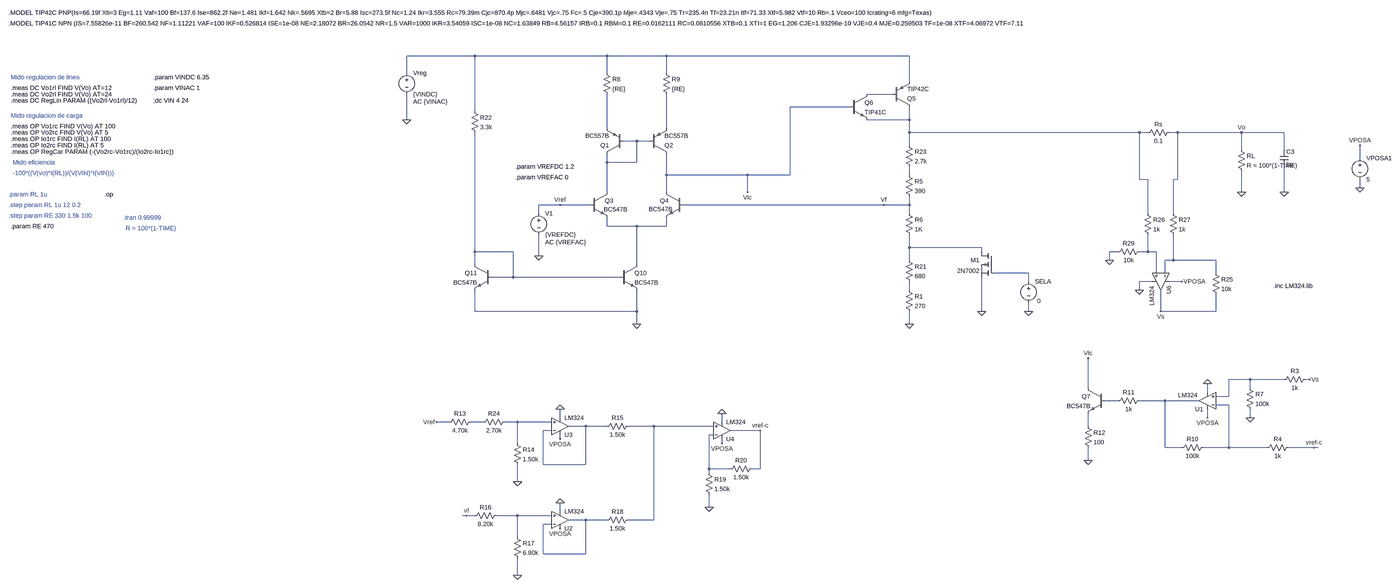
[diagram p0: schematic Simulacion - v8.asc, whole sheet]
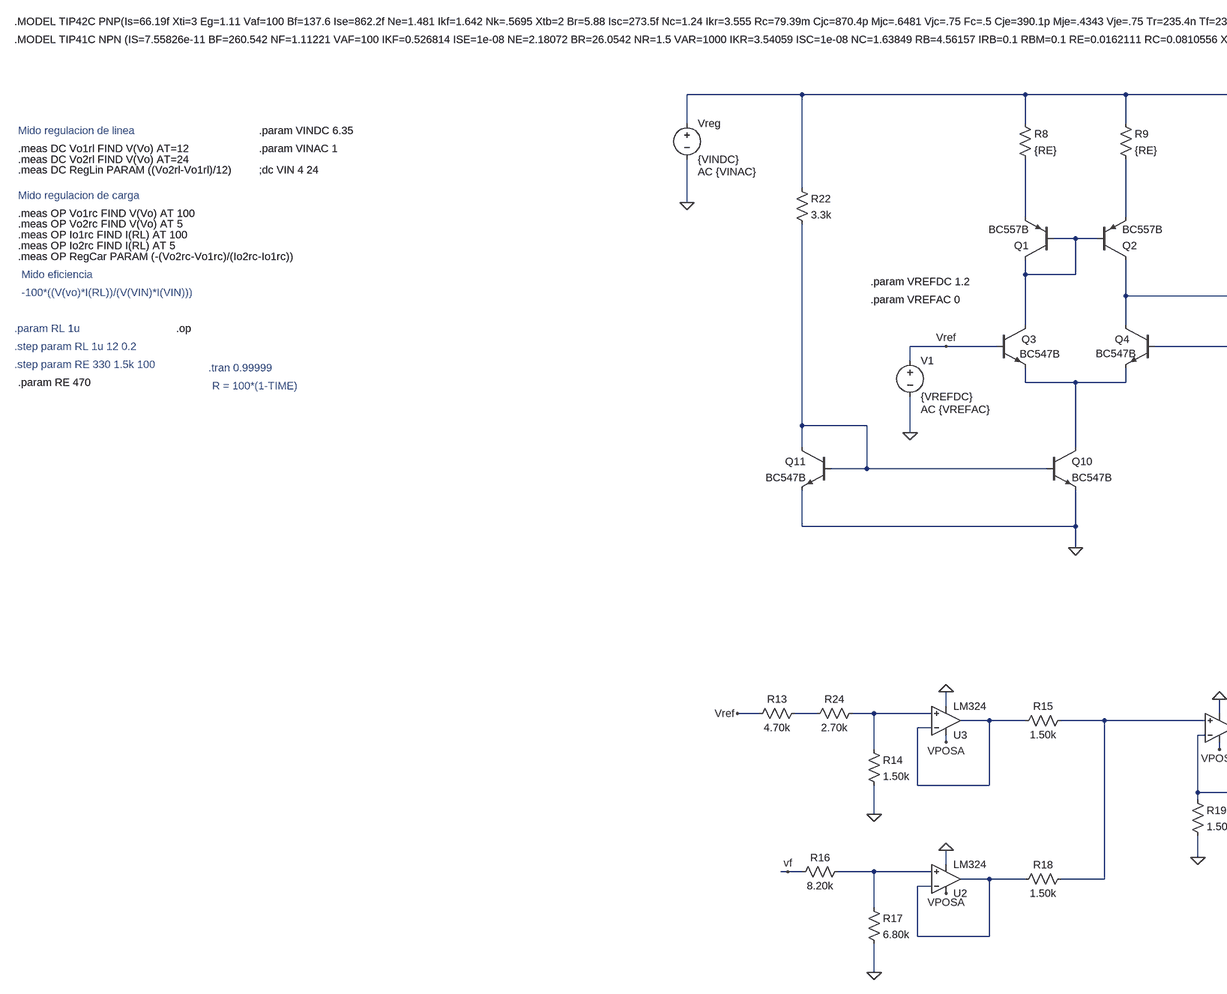
[diagram p1: schematic Simulacion - v8.asc, part, row 1 of 1, column 1 of 2]
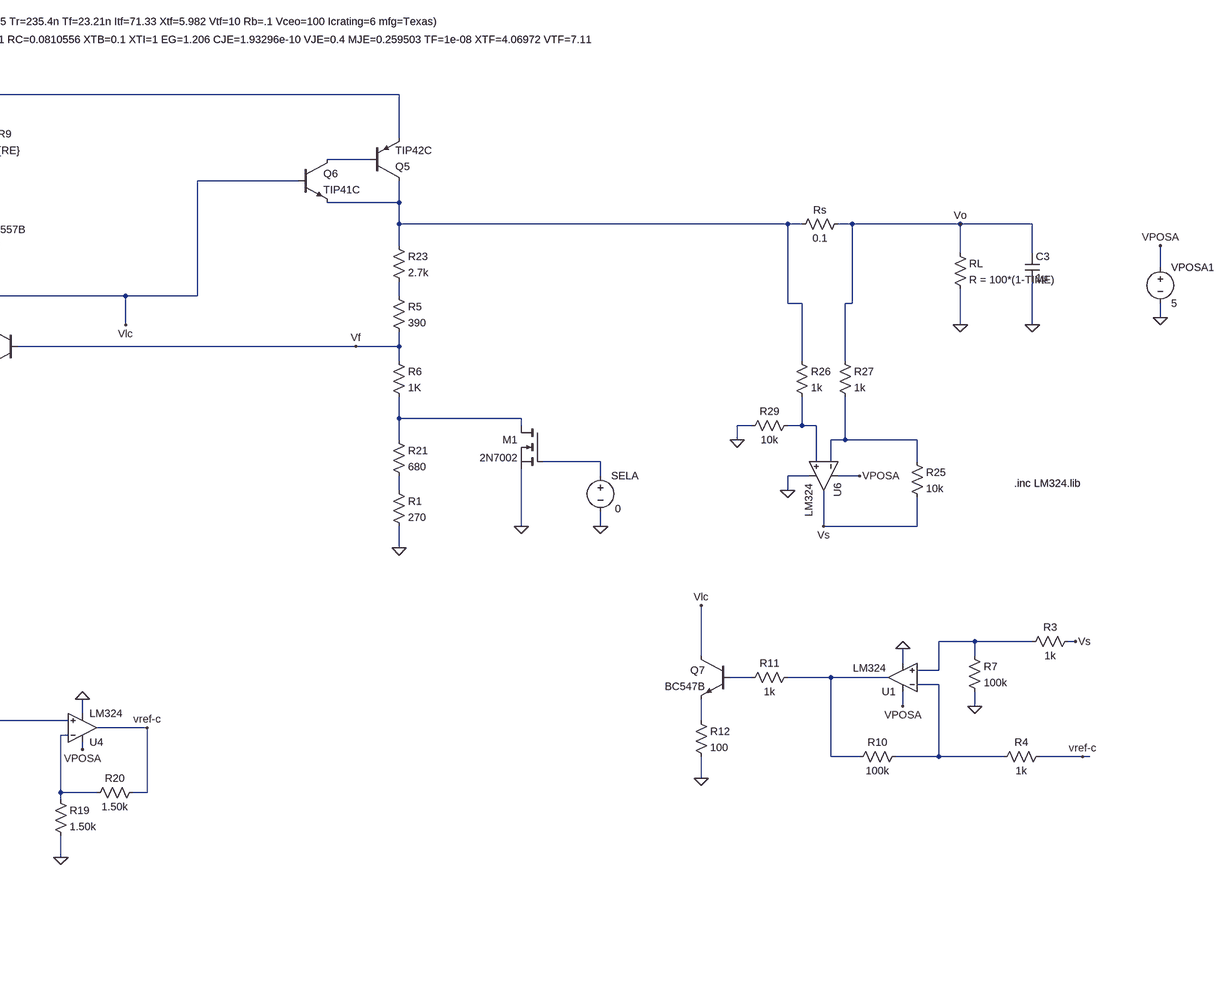
[diagram p2: schematic Simulacion - v8.asc, part, row 1 of 1, column 2 of 2]
Simulacion - v8.asc, the LTspice schematic file:
Version 4
SHEET 1 10276 2748
WIRE -160 -288 -416 -288
WIRE 336 -288 -160 -288
WIRE 560 -288 336 -288
WIRE 1472 -288 560 -288
WIRE -416 -224 -416 -288
WIRE 336 -224 336 -288
WIRE 560 -224 560 -288
WIRE 1472 -192 1472 -288
WIRE 1408 -144 1312 -144
WIRE 1248 -96 1024 -96
WIRE -160 -80 -160 -288
WIRE -416 -48 -416 -144
WIRE 1472 -48 1472 -96
WIRE 1472 -48 1312 -48
WIRE 336 -16 336 -144
WIRE 560 -16 560 -144
WIRE 1472 0 1472 -48
WIRE 2336 0 1472 0
WIRE 2368 0 2336 0
WIRE 2480 0 2448 0
WIRE 2720 0 2480 0
WIRE 2880 0 2720 0
WIRE 448 32 400 32
WIRE 496 32 448 32
WIRE 1472 48 1472 0
WIRE 2720 64 2720 0
WIRE 2880 64 2880 0
WIRE 3248 96 3248 48
WIRE 336 112 336 80
WIRE 448 112 448 32
WIRE 448 112 336 112
WIRE 560 160 560 80
WIRE 864 160 560 160
WIRE 1024 160 1024 -96
WIRE 1024 160 864 160
WIRE 1472 160 1472 128
WIRE 2336 176 2336 0
WIRE 2368 176 2336 176
WIRE 2480 176 2480 0
WIRE 2480 176 2464 176
WIRE 3248 208 3248 176
WIRE 336 224 336 112
WIRE 560 224 560 160
WIRE 864 224 864 160
WIRE 2720 224 2720 144
WIRE 2880 224 2880 128
WIRE 160 272 80 272
WIRE 272 272 160 272
WIRE 1376 272 624 272
WIRE 1472 272 1472 240
WIRE 1472 272 1376 272
WIRE 80 304 80 272
WIRE 1472 304 1472 272
WIRE 2368 304 2368 176
WIRE 2464 304 2464 176
WIRE 336 352 336 320
WIRE 448 352 336 352
WIRE 560 352 560 320
WIRE 560 352 448 352
WIRE 1472 432 1472 384
WIRE 1744 432 1472 432
WIRE -160 448 -160 0
WIRE -16 448 -160 448
WIRE 1744 448 1744 432
WIRE 2256 448 2224 448
WIRE 2368 448 2368 384
WIRE 2368 448 2336 448
WIRE 2400 448 2368 448
WIRE 80 464 80 384
WIRE 1472 480 1472 432
WIRE 2224 480 2224 448
WIRE 2464 480 2464 384
WIRE 2464 480 2432 480
WIRE 2624 480 2464 480
WIRE -160 496 -160 448
WIRE 448 496 448 352
WIRE 1920 528 1792 528
WIRE 2400 528 2400 448
WIRE 2432 528 2432 480
WIRE 2624 528 2624 480
WIRE -16 544 -16 448
WIRE -16 544 -96 544
WIRE 384 544 -16 544
WIRE 1920 560 1920 528
WIRE 2384 560 2336 560
WIRE 2496 560 2448 560
WIRE 1472 592 1472 560
WIRE 2336 592 2336 560
WIRE -160 672 -160 592
WIRE 448 672 448 592
WIRE 448 672 -160 672
WIRE 1744 672 1744 544
WIRE 1920 672 1920 640
WIRE 2416 672 2416 592
WIRE 2624 672 2624 608
WIRE 2624 672 2416 672
WIRE 448 720 448 672
WIRE 1472 720 1472 672
WIRE 2752 928 2672 928
WIRE 2880 928 2752 928
WIRE 2976 928 2960 928
WIRE 2144 960 2144 848
WIRE 2752 960 2752 928
WIRE 2592 976 2592 944
WIRE 2672 992 2672 928
WIRE 2672 992 2624 992
WIRE 2256 1008 2208 1008
WIRE 2432 1008 2336 1008
WIRE 2560 1008 2432 1008
WIRE 2672 1024 2624 1024
WIRE 160 1072 160 1040
WIRE 2592 1072 2592 1040
WIRE 2752 1072 2752 1040
WIRE -256 1088 -304 1088
WIRE -128 1088 -176 1088
WIRE 0 1088 -48 1088
WIRE 128 1088 0 1088
WIRE 768 1088 768 1056
WIRE 256 1104 192 1104
WIRE 336 1104 256 1104
WIRE 512 1104 416 1104
WIRE 736 1104 512 1104
WIRE 2144 1104 2144 1056
WIRE 128 1120 96 1120
WIRE 912 1120 800 1120
WIRE 736 1136 720 1136
WIRE 160 1152 160 1136
WIRE 0 1168 0 1088
WIRE 768 1168 768 1152
WIRE 2432 1184 2432 1008
WIRE 2496 1184 2432 1184
WIRE 2672 1184 2672 1024
WIRE 2672 1184 2576 1184
WIRE 2816 1184 2672 1184
WIRE 2992 1184 2896 1184
WIRE 3008 1184 2992 1184
WIRE 2144 1232 2144 1184
WIRE 96 1248 96 1120
WIRE 256 1248 256 1104
WIRE 256 1248 96 1248
WIRE 720 1264 720 1136
WIRE 800 1264 720 1264
WIRE 912 1264 912 1120
WIRE 912 1264 880 1264
WIRE 720 1280 720 1264
WIRE 0 1312 0 1248
WIRE 720 1408 720 1360
WIRE 160 1424 160 1392
WIRE -192 1440 -208 1440
WIRE -160 1440 -192 1440
WIRE 0 1440 -80 1440
WIRE 128 1440 0 1440
WIRE 256 1456 192 1456
WIRE 336 1456 256 1456
WIRE 512 1456 512 1104
WIRE 512 1456 416 1456
WIRE 128 1472 96 1472
WIRE 0 1520 0 1440
WIRE 96 1584 96 1472
WIRE 256 1584 256 1456
WIRE 256 1584 96 1584
WIRE 0 1664 0 1600
FLAG 1376 272 Vf
FLAG 2752 1072 0
FLAG 2144 1232 0
FLAG 80 464 0
FLAG 0 1312 0
FLAG 0 1664 0
FLAG 720 1408 0
FLAG 2720 224 0
FLAG 2880 224 0
FLAG 160 1152 VPOSA
FLAG 768 1168 VPOSA
FLAG 2496 560 VPOSA
FLAG 2592 1072 VPOSA
FLAG 160 1488 VPOSA
FLAG -416 -48 0
FLAG 1744 672 0
FLAG 1472 720 0
FLAG 1920 672 0
FLAG 448 720 0
FLAG 2720 0 Vo
FLAG 3248 208 0
FLAG 3248 48 VPOSA
FLAG 160 272 Vref
FLAG 2224 480 0
FLAG 160 1392 0
FLAG 160 1040 0
FLAG 768 1056 0
FLAG 2592 944 0
FLAG 2336 592 0
FLAG -192 1440 vf
FLAG -304 1088 Vref
FLAG 2992 1184 vref-c
FLAG 2976 928 Vs
FLAG 2416 672 Vs
FLAG 2144 848 Vlc
FLAG 864 224 Vlc
FLAG 912 1120 vref-c
SYMBOL pnp 400 80 R180
SYMATTR InstName Q1
SYMATTR Value BC557B
SYMBOL pnp 496 80 M180
SYMATTR InstName Q2
SYMATTR Value BC557B
SYMBOL npn 272 224 R0
WINDOW 3 52 65 Left 2
SYMATTR Value BC547B
SYMATTR InstName Q3
SYMBOL npn 624 224 M0
WINDOW 3 42 64 Left 2
SYMATTR Value BC547B
SYMATTR InstName Q4
SYMBOL pnp 1408 -96 M180
SYMATTR InstName Q5
SYMATTR Value TIP42C
SYMBOL npn 1248 -144 R0
SYMATTR InstName Q6
SYMATTR Value TIP41C
SYMBOL res 1456 144 R0
SYMATTR InstName R5
SYMATTR Value 390
SYMBOL res 1456 288 R0
SYMATTR InstName R6
SYMATTR Value 1K
SYMBOL res 2704 48 R0
SYMATTR InstName RL
SYMATTR Value R = 100*(1-TIME)
SYMBOL voltage 80 288 R0
WINDOW 123 24 124 Left 2
WINDOW 39 0 0 Left 0
SYMATTR Value2 AC {VREFAC}
SYMATTR InstName V1
SYMATTR Value {VREFDC}
SYMBOL voltage -416 -240 R0
WINDOW 123 24 124 Left 2
WINDOW 39 0 0 Left 0
SYMATTR Value2 AC {VINAC}
SYMATTR InstName Vreg
SYMATTR Value {VINDC}
SYMBOL res 320 -240 R0
SYMATTR InstName R8
SYMATTR Value {RE}
SYMBOL res 544 -240 R0
SYMATTR InstName R9
SYMATTR Value {RE}
SYMBOL cap 2864 64 R0
SYMATTR InstName C3
SYMATTR Value 1µ
SYMBOL res 2464 -16 R90
WINDOW 0 0 56 VBottom 2
WINDOW 3 32 56 VTop 2
SYMATTR InstName Rs
SYMATTR Value 0.1
SYMBOL res 2976 912 R90
WINDOW 0 0 56 VBottom 2
WINDOW 3 32 56 VTop 2
SYMATTR InstName R3
SYMATTR Value 1k
SYMBOL res 2912 1168 R90
WINDOW 0 0 56 VBottom 2
WINDOW 3 32 56 VTop 2
SYMATTR InstName R4
SYMATTR Value 1k
SYMBOL res 2736 944 R0
SYMATTR InstName R7
SYMATTR Value 100k
SYMBOL res 2592 1168 R90
WINDOW 0 0 56 VBottom 2
WINDOW 3 32 56 VTop 2
SYMATTR InstName R10
SYMATTR Value 100k
SYMBOL res 2352 992 R90
WINDOW 0 0 56 VBottom 2
WINDOW 3 32 56 VTop 2
SYMATTR InstName R11
SYMATTR Value 1k
SYMBOL res 2128 1088 R0
SYMATTR InstName R12
SYMATTR Value 100
SYMBOL npn 2208 960 M0
SYMATTR InstName Q7
SYMATTR Value BC547B
SYMBOL res -160 1072 R90
WINDOW 0 0 56 VBottom 2
WINDOW 3 32 56 VTop 2
SYMATTR InstName R13
SYMATTR Value 4.70k
SYMBOL res -16 1152 R0
SYMATTR InstName R14
SYMATTR Value 1.50k
SYMBOL res 432 1088 R90
WINDOW 0 0 56 VBottom 2
WINDOW 3 32 56 VTop 2
SYMATTR InstName R15
SYMATTR Value 1.50k
SYMBOL res -64 1424 R90
WINDOW 0 0 56 VBottom 2
WINDOW 3 32 56 VTop 2
SYMATTR InstName R16
SYMATTR Value 8.20k
SYMBOL res -16 1504 R0
SYMATTR InstName R17
SYMATTR Value 6.80k
SYMBOL res 432 1440 R90
WINDOW 0 0 56 VBottom 2
WINDOW 3 32 56 VTop 2
SYMATTR InstName R18
SYMATTR Value 1.50k
SYMBOL res 896 1248 R90
WINDOW 0 0 56 VBottom 2
WINDOW 3 32 56 VTop 2
SYMATTR InstName R20
SYMATTR Value 1.50k
SYMBOL res 704 1264 R0
SYMATTR InstName R19
SYMATTR Value 1.50k
SYMBOL res 1456 464 R0
SYMATTR InstName R21
SYMATTR Value 680
SYMBOL nmos 1792 448 M0
SYMATTR InstName M1
SYMATTR Value 2N7002
SYMBOL voltage 1920 544 R0
WINDOW 3 32 89 Left 2
WINDOW 123 0 0 Left 0
WINDOW 39 0 0 Left 0
SYMATTR Value 0
SYMATTR InstName SELA
SYMBOL npn 384 496 R0
SYMATTR InstName Q10
SYMATTR Value BC547B
SYMBOL npn -96 496 M0
SYMATTR InstName Q11
SYMATTR Value BC547B
SYMBOL res -176 -96 R0
SYMATTR InstName R22
SYMATTR Value 3.3k
SYMBOL res 1456 32 R0
SYMATTR InstName R23
SYMATTR Value 2.7k
SYMBOL OpAmps\\opamp2 2480 560 R90
SYMATTR InstName U6
SYMATTR Value LM324
SYMBOL OpAmps\\opamp2 2592 1072 R180
WINDOW 3 36 85 Left 2
SYMATTR Value LM324
SYMATTR InstName U1
SYMBOL OpAmps\\opamp2 160 1168 M180
SYMATTR InstName U3
SYMATTR Value LM324
SYMBOL OpAmps\\opamp2 768 1184 M180
SYMATTR InstName U4
SYMATTR Value LM324
SYMBOL voltage 3248 80 R0
SYMATTR InstName VPOSA1
SYMATTR Value 5
SYMBOL res -32 1072 R90
WINDOW 0 0 56 VBottom 2
WINDOW 3 32 56 VTop 2
SYMATTR InstName R24
SYMATTR Value 2.70k
SYMBOL res 2608 512 R0
SYMATTR InstName R25
SYMATTR Value 10k
SYMBOL res 2352 288 R0
SYMATTR InstName R26
SYMATTR Value 1k
SYMBOL res 2448 288 R0
SYMATTR InstName R27
SYMATTR Value 1k
SYMBOL res 2352 432 R90
WINDOW 0 0 56 VBottom 2
WINDOW 3 32 56 VTop 2
SYMATTR InstName R29
SYMATTR Value 10k
SYMBOL res 1456 576 R0
SYMATTR InstName R1
SYMATTR Value 270
SYMBOL OpAmps\\opamp2 160 1520 M180
SYMATTR InstName U2
SYMATTR Value LM324
TEXT -1552 232 Left 2 !.op
TEXT -1368 -208 Left 2 !.param VINDC 6.35
TEXT -1368 -168 Left 2 !.param VINAC 1
TEXT -8 128 Left 2 !.param VREFDC 1.2
TEXT -8 168 Left 2 !.param VREFAC 0
TEXT -1912 232 Left 2 ;.param RL 1u
TEXT -1368 -120 Left 2 !;dc VIN 4 24
TEXT -1912 312 Left 2 ;.step param RE 330 1.5k 100
TEXT -1912 272 Left 2 ;.step param RL 1u 12 0.2
TEXT -1904 -208 Left 2 ;Mido regulacion de linea
TEXT -1904 -168 Left 2 !.meas DC Vo1rl FIND V(Vo) AT=12
TEXT -1904 -144 Left 2 !.meas DC Vo2rl FIND V(Vo) AT=24
TEXT -1904 -120 Left 2 !.meas DC RegLin PARAM ((Vo2rl-Vo1rl)/12)
TEXT -1904 -64 Left 2 ;Mido regulacion de carga
TEXT -1904 -24 Left 2 !.meas OP Vo1rc FIND V(Vo) AT 100
TEXT -1904 0 Left 2 !.meas OP Vo2rc FIND V(Vo) AT 5
TEXT -1904 24 Left 2 !.meas OP Io1rc FIND I(RL) AT 100
TEXT -1904 48 Left 2 !.meas OP Io2rc FIND I(RL) AT 5
TEXT -1896 112 Left 2 ;Mido eficiencia
TEXT -1896 152 Left 2 ;-100*((V(vo)*I(RL))/(V(VIN)*I(VIN)))
TEXT -1904 72 Left 2 !.meas OP RegCar PARAM (-(Vo2rc-Vo1rc)/(Io2rc-Io1rc))
TEXT -1912 -544 Left 2 !.MODEL TIP42C PNP(Is=66.19f Xti=3 Eg=1.11 Vaf=100 Bf=137.6 Ise=862.2f Ne=1.481 Ikf=1.642 Nk=.5695 Xtb=2 Br=5.88 Isc=273.5f Nc=1.24 Ikr=3.555 Rc=79.39m Cjc=870.4p Mjc=.6481 Vjc=.75 Fc=.5 Cje=390.1p Mje=.4343 Vje=.75 Tr=235.4n Tf=23.21n Itf=71.33 Xtf=5.982 Vtf=10 Rb=.1 Vceo=100 Icrating=6 mfg=Texas)
TEXT -1912 -504 Left 2 !.MODEL TIP41C NPN (IS=7.55826e-11 BF=260.542 NF=1.11221 VAF=100 IKF=0.526814 ISE=1e-08 NE=2.18072 BR=26.0542 NR=1.5 VAR=1000 IKR=3.54059 ISC=1e-08 NC=1.63849 RB=4.56157 IRB=0.1 RBM=0.1 RE=0.0162111 RC=0.0810556 XTB=0.1 XTI=1 EG=1.206 CJE=1.93296e-10 VJE=0.4 MJE=0.259503 TF=1e-08 XTF=4.06972 VTF=7.1157 ITF=0.001 CJC=1.09657e-10 VJC=0.730921 MJC=0.23 XCJC=0.803085 FC=0.8 TR=9.01013e-08 PTF=0 Vceo=100 ICrating=6 mfg=ON_Semi)
TEXT 2840 576 Left 2 !.inc LM324.lib
TEXT -1480 320 Left 2 ;.tran 0.99999
TEXT -1472 360 Left 2 ;R = 100*(1-TIME)
TEXT -1904 352 Left 2 !.param RE 470

The netlist it stands for:
* Simulacion - v8.asc
Q1 N006 N006 N004 0 BC557B
Q2 Vlc N006 N005 0 BC557B
Q3 N006 Vref N008 0 BC547B
Q4 Vlc Vf N008 0 BC547B
Q5 N003 N002 N001 0 TIP42C
Q6 N002 Vlc N003 0 TIP41C
R5 N007 Vf 390
R6 Vf N009 1K
RL Vo 0 R = 100*(1-TIME)
V1 Vref 0 {VREFDC} AC {VREFAC}
Vreg N001 0 {VINDC} AC {VINAC}
R8 N001 N004 {RE}
R9 N001 N005 {RE}
C3 Vo 0 1µ
Rs Vo N003 0.1
R3 Vs N015 1k
R4 vref-c N018 1k
R7 N015 0 100k
R10 N018 N017 100k
R11 N017 N016 1k
R12 N023 0 100
Q7 Vlc N016 N023 0 BC547B
R13 N019 Vref 4.70k
R14 N020 0 1.50k
R15 N022 N021 1.50k
R16 N025 Vf 8.20k
R17 N025 0 6.80k
R18 N022 N026 1.50k
R20 vref-c N024 1.50k
R19 N024 0 1.50k
R21 N009 N014 680
M1 N009 N013 0 0 2N7002
V§SELA N013 0 0
Q10 N008 N010 0 0 BC547B
Q11 N010 N010 0 0 BC547B
R22 N001 N010 3.3k
R23 N003 N007 2.7k
XU6 N011 N012 VPOSA 0 Vs LM324  ; pins In+ In- V+ V- OUT
XU1 N015 N018 VPOSA 0 N017 LM324  ; pins In+ In- V+ V- OUT
XU3 N020 N021 VPOSA 0 N021 LM324  ; pins In+ In- V+ V- OUT
XU4 N022 N024 VPOSA 0 vref-c LM324  ; pins In+ In- V+ V- OUT
VPOSA1 VPOSA 0 5
R24 N020 N019 2.70k
R25 N012 Vs 10k
R26 N003 N011 1k
R27 Vo N012 1k
R29 N011 0 10k
R1 N014 0 270
XU2 N025 N026 VPOSA 0 N026 LM324  ; pins In+ In- V+ V- OUT
.model NPN NPN
.model PNP PNP
.lib standard.bjt
.model NMOS NMOS
.model PMOS PMOS
.lib standard.mos
.op
.param VINDC 6.35
.param VINAC 1
.param VREFDC 1.2
.param VREFAC 0
* .param RL 1u
;dc VIN 4 24
* .step param RE 330 1.5k 100
* .step param RL 1u 12 0.2
* Mido regulacion de linea
.meas DC Vo1rl FIND V(Vo) AT=12
.meas DC Vo2rl FIND V(Vo) AT=24
.meas DC RegLin PARAM ((Vo2rl-Vo1rl)/12)
* Mido regulacion de carga
.meas OP Vo1rc FIND V(Vo) AT 100
.meas OP Vo2rc FIND V(Vo) AT 5
.meas OP Io1rc FIND I(RL) AT 100
.meas OP Io2rc FIND I(RL) AT 5
* Mido eficiencia
* -100*((V(vo)*I(RL))/(V(VIN)*I(VIN)))
.meas OP RegCar PARAM (-(Vo2rc-Vo1rc)/(Io2rc-Io1rc))
.MODEL TIP42C PNP(Is=66.19f Xti=3 Eg=1.11 Vaf=100 Bf=137.6 Ise=862.2f Ne=1.481 Ikf=1.642 Nk=.5695 Xtb=2 Br=5.88 Isc=273.5f Nc=1.24 Ikr=3.555 Rc=79.39m Cjc=870.4p Mjc=.6481 Vjc=.75 Fc=.5 Cje=390.1p Mje=.4343 Vje=.75 Tr=235.4n Tf=23.21n Itf=71.33 Xtf=5.982 Vtf=10 Rb=.1 Vceo=100 Icrating=6 mfg=Texas)
.MODEL TIP41C NPN (IS=7.55826e-11 BF=260.542 NF=1.11221 VAF=100 IKF=0.526814 ISE=1e-08 NE=2.18072 BR=26.0542 NR=1.5 VAR=1000 IKR=3.54059 ISC=1e-08 NC=1.63849 RB=4.56157 IRB=0.1 RBM=0.1 RE=0.0162111 RC=0.0810556 XTB=0.1 XTI=1 EG=1.206 CJE=1.93296e-10 VJE=0.4 MJE=0.259503 TF=1e-08 XTF=4.06972 VTF=7.1157 ITF=0.001 CJC=1.09657e-10 VJC=0.730921 MJC=0.23 XCJC=0.803085 FC=0.8 TR=9.01013e-08 PTF=0 Vceo=100 ICrating=6 mfg=ON_Semi)
.inc LM324.lib
* .tran 0.99999
* R = 100*(1-TIME)
.param RE 470
.backanno
.end